# Altium schematic sheet F103.SchDoc
size A; SheetNumber: 1; SheetTotal: 1
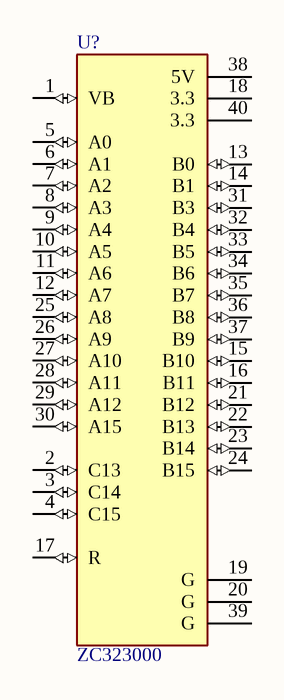
[diagram p0: F103.SchDoc]

## Parts
U?  ZC323000  [MODULE_ZC323000]

## Nets

Not connected (* = marked no-connect by the designer): U? 1(VB) 2(C13) 3(C14) 4(C15) 5(A0) 6(A1) 7(A2) 8(A3) 9(A4) 10(A5) 11(A6) 12(A7) 13(B0) 14(B1) 15(B10) 16(B11) 17(R) 18(3.3) 19(G) 20(G) 21(B12) 22(B13) 23(B14) 24(B15) 25(A8) 26(A9) 27(A10) 28(A11) 29(A12) 30(A15) 31(B3) 32(B4) 33(B5) 34(B6) 35(B7) 36(B8) 37(B9) 38(5V) 39(G) 40(3.3)

## Library data of the parts
U? = ZC323000: STM32F103C8T6 ARM STM32 Minimum System Development Board Module For Arduino; Package: None; MP: ZC323000; Value: *; Availability: Unavailable; Price: None